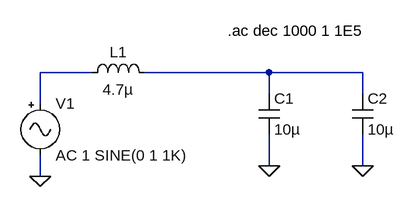
[diagram p0: schematic P1_Filter.asc]
P1_Filter.asc, the LTspice schematic file:
Version 4
SHEET 1 880 680
WIRE 32 144 -48 144
WIRE 304 144 112 144
WIRE 448 144 304 144
WIRE 304 176 304 144
WIRE 448 176 448 144
WIRE -48 192 -48 144
WIRE 304 288 304 240
WIRE 448 288 448 240
WIRE -48 304 -48 272
FLAG 304 288 0
FLAG 448 288 0
FLAG -48 304 0
SYMBOL ind 16 160 R270
WINDOW 0 32 56 VTop 2
WINDOW 3 5 56 VBottom 2
SYMATTR InstName L1
SYMATTR Value 4.7µ
SYMATTR SpiceLine Rser=.11
SYMBOL cap 288 176 R0
SYMATTR InstName C1
SYMATTR Value 10µ
SYMBOL cap 432 176 R0
SYMATTR InstName C2
SYMATTR Value 10µ
SYMBOL Misc\\signal -48 176 R0
SYMATTR InstName V1
SYMATTR Value AC 1 SINE(0 1 1K)
TEXT 240 80 Left 2 !.ac dec 1000 1 1E5

The netlist it stands for:
* P1_Filter.asc
L1 N001 N002 4.7µ Rser=.11
C1 N002 0 10µ
C2 N002 0 10µ
V1 N001 0 AC 1 SINE(0 1 1K)
.ac dec 1000 1 1E5
.backanno
.end